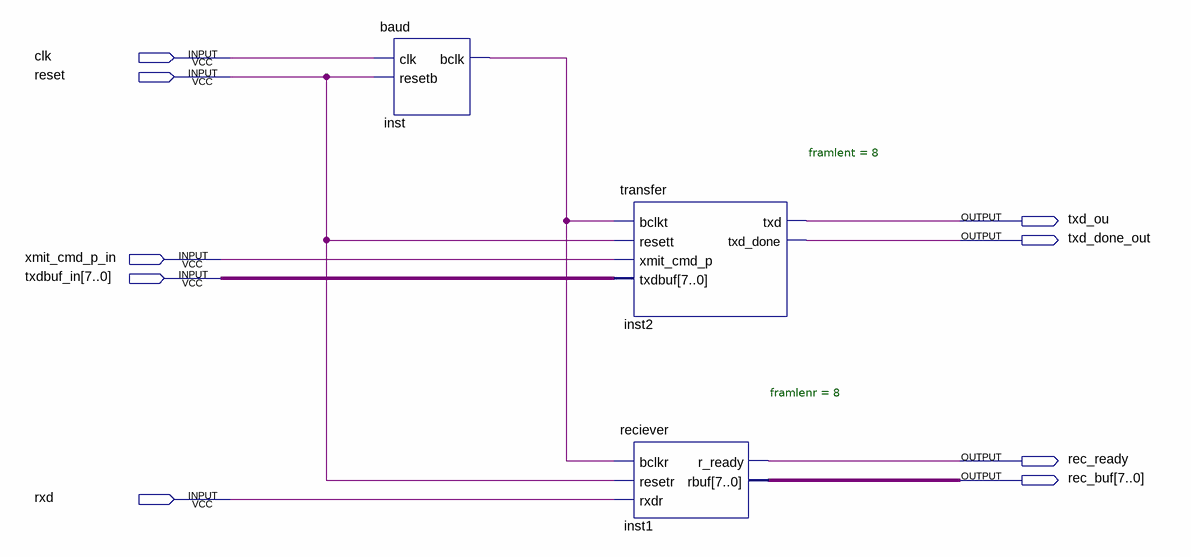
[diagram p0: schematic sheet]
// Quartus schematic Uart.bdf as structural Verilog: 3 symbols, 9 pins
module Uart (
  input  clk,
  input  reset,
  input  xmit_cmd_p_in,
  input  [7:0] txdbuf_in,
  input  rxd,
  output txd_ou,
  output txd_done_out,
  output rec_ready,
  output [7:0] rec_buf
);

  wire inst_bclk;

  baud inst (.clk(clk), .resetb(reset), .bclk(inst_bclk));
  transfer #(.framlent(8)) inst2 (
    .bclkt(inst_bclk), .resett(reset), .xmit_cmd_p(xmit_cmd_p_in), .txdbuf(txdbuf_in), .txd(txd_ou),
    .txd_done(txd_done_out));
  reciever #(.framlenr(8)) inst1 (.bclkr(inst_bclk), .resetr(reset), .rxdr(rxd), .r_ready(rec_ready), .rbuf(rec_buf));
endmodule
